# Altium schematic sheet System.SchDoc
size A4
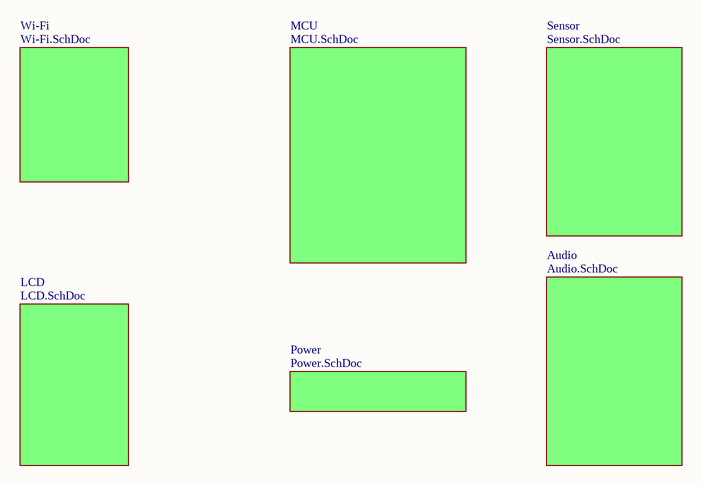
[diagram p0: System.SchDoc]

## Sub-sheets
Audio = Audio.SchDoc: no entries
LCD = LCD.SchDoc: no entries
MCU = MCU.SchDoc: no entries
Power = Power.SchDoc: no entries
Sensor = Sensor.SchDoc: no entries
Wi-Fi = Wi-Fi.SchDoc: no entries